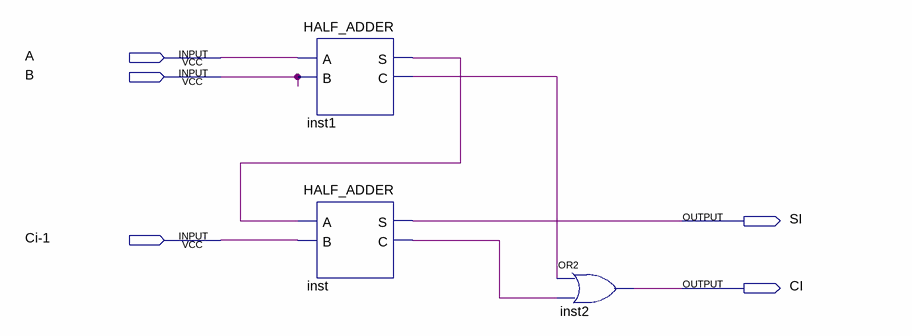
[diagram p0: schematic sheet]
// Quartus schematic full_adder.bdf as structural Verilog: 3 symbols, 5 pins
module full_adder (
  input  A,
  input  B,
  input  \Ci-1 ,
  output SI,
  output CI
);

  wire inst1_c, inst1_s, inst_c;

  HALF_ADDER inst1 (.A(A), .B(B), .S(inst1_s), .C(inst1_c));
  HALF_ADDER inst (.A(inst1_s), .B(\Ci-1 ), .S(SI), .C(inst_c));
  or inst2 (CI, inst1_c, inst_c);
endmodule
